# Altium schematic sheet os-solar.SchDoc: OS-Solar
size A3; CompanyName: Kaasa5; DrawnBy: Nathan Kuchel; Organization: Kaasa5; Revision: 1.0.0; SheetNumber: 1; SheetTotal: 4; SheetTitle: Top Level
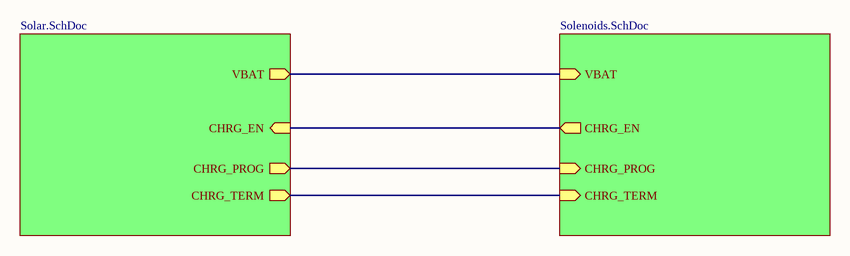
[diagram p0: os-solar.SchDoc]

## Sub-sheets
Designator = Solar.SchDoc: VBAT (out), CHRG_PROG (out), CHRG_TERM (out), CHRG_EN (in)
Designator = Solenoids.SchDoc: VBAT (in), CHRG_PROG (in), CHRG_EN (out), CHRG_TERM (in)

## Nets
(unnamed): sheet Designator/VBAT, sheet Designator/VBAT
(unnamed): sheet Designator/CHRG_PROG, sheet Designator/CHRG_PROG
(unnamed): sheet Designator/CHRG_TERM, sheet Designator/CHRG_TERM
(unnamed): sheet Designator/CHRG_EN, sheet Designator/CHRG_EN

## Notes on the sheet
- Project:
- Variant:
- Title:
- File:
- Drawn By:
- Print Date:
- Size:
- A3
- Master:
- Approved By:
- Sheet
- Revision
- Date:
- of
- Copyright © 2018 KAASA5